# EAGLE design Sigfox_Featherwing (EAGLE 9.4.1)
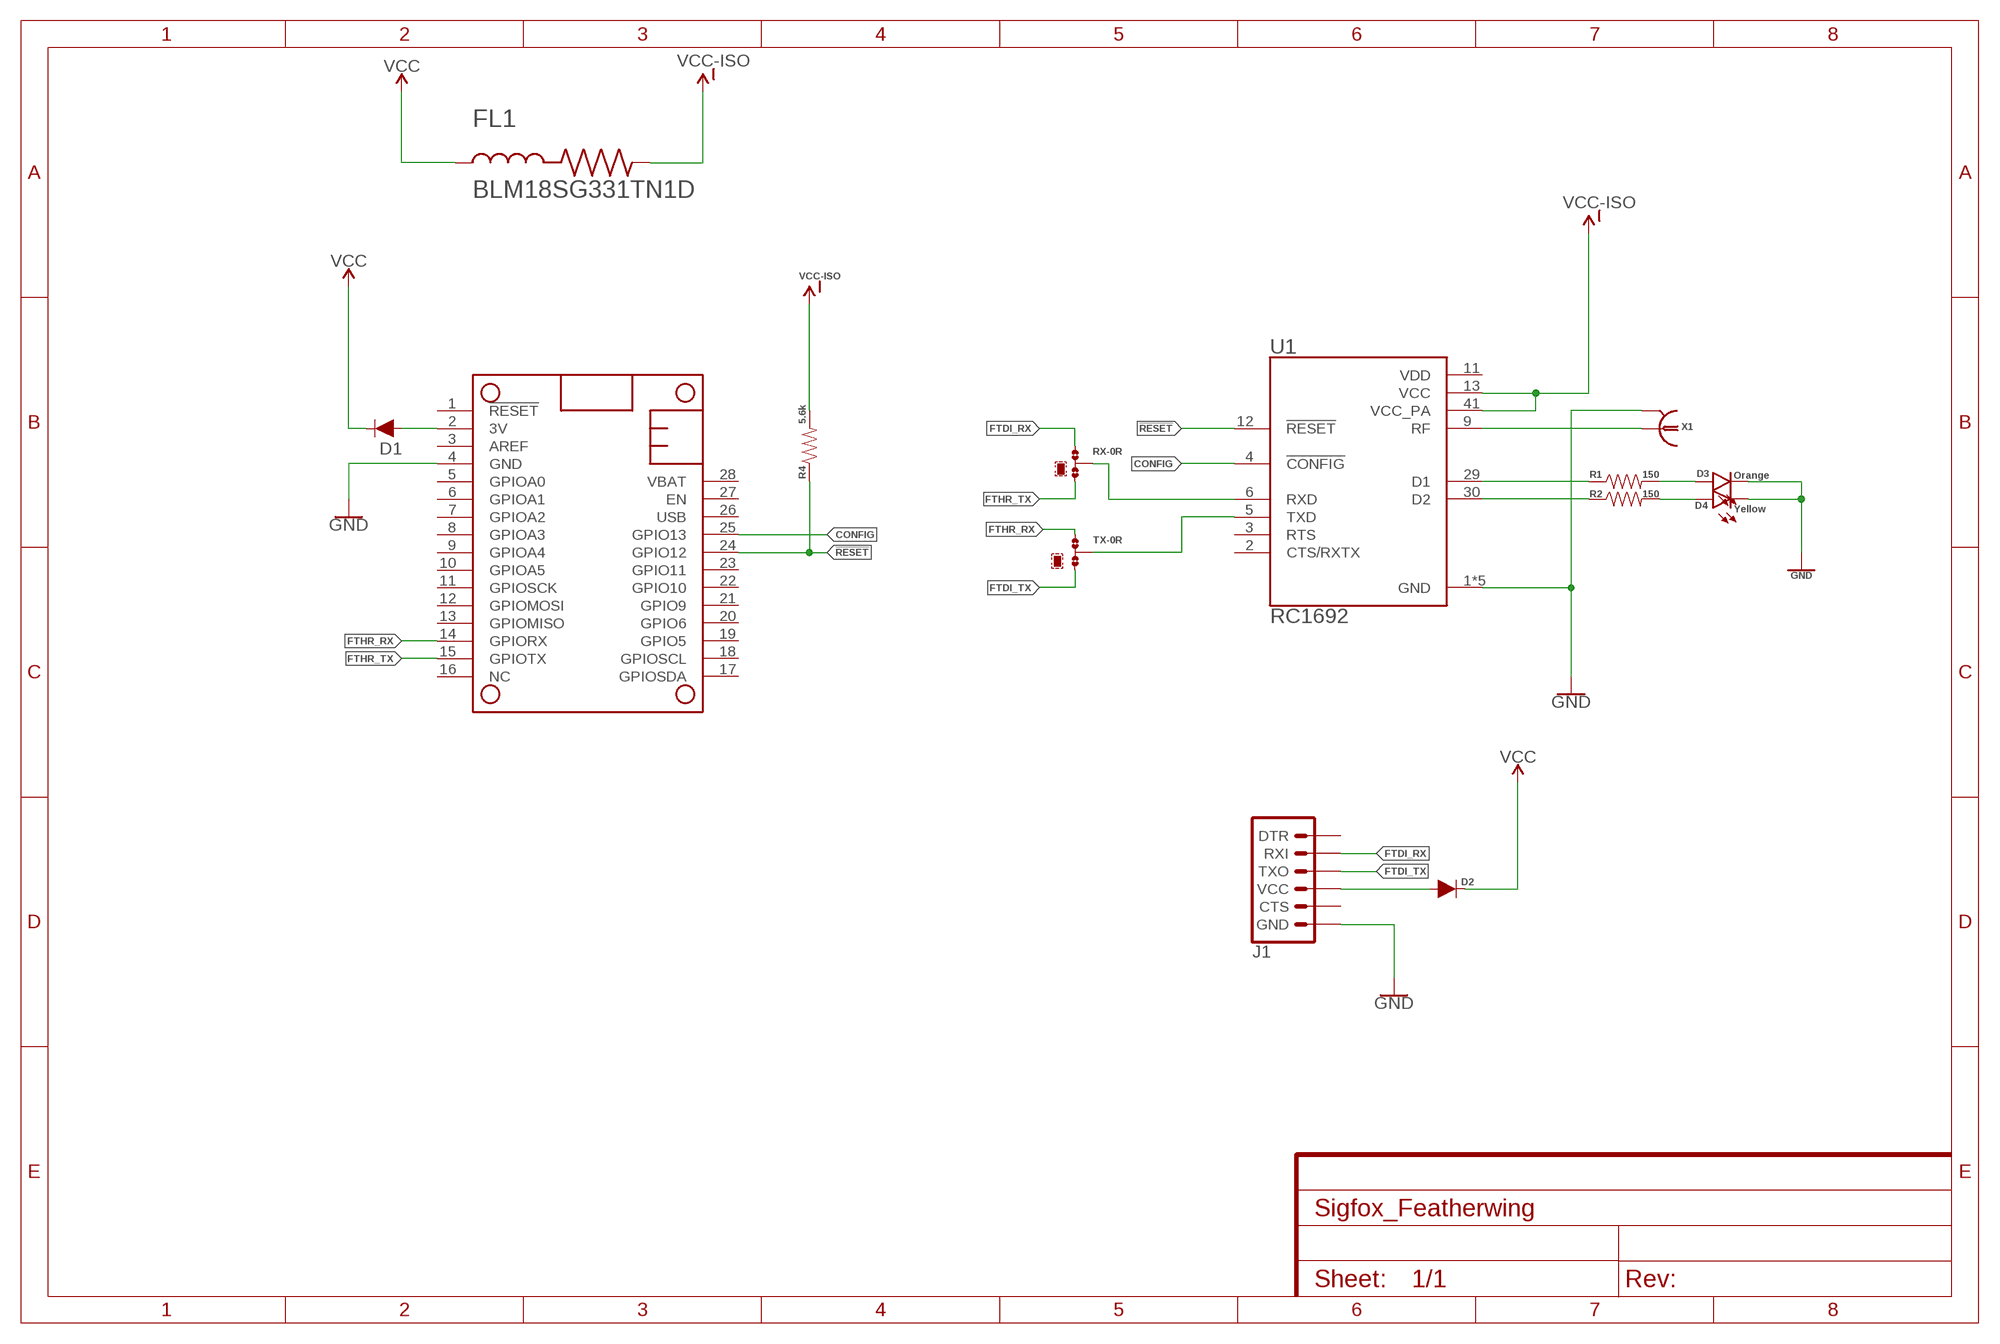
[diagram p0: schematic, sheet 1]

## Parts
D1  250mA/100V  DIODE-BAS16J  [SOD-323]
D2  250mA/100V  DIODE-BAS16J  [SOD-323]
D3  Orange  LED-YELLOW0603  [LED-0603]
D4  Yellow  LED-YELLOW0603  [LED-0603]
FL1  BLM18SG331TN1D  [BEADC1608X65N]
J1  6_PIN_SERIAL_TARGETSILK  [6_PIN_SERIAL_TARGET_SIDE_W_SILK]
MS1  FEATHERWING  [FEATHERWING]
R1  150  150OHM-0603-1/10W-1%  [0603]
R2  150  150OHM-0603-1/10W-1%  [0603]
R4  5.6k  5.6KOHM-0603-1/10W-1%  [0603]
RX  0R-JUMPB  [B0R-JMP]
TX  0R-JUMPB  [B0R-JMP]
U1  RC1692  [MODULE_RC1682-SIG]
X1  SMA-SMD  [SMA-SMD]

## Nets
3V: D1.A MS1.2(3V)
!RESET: MS1.24(GPIO12) R4.1 U1.12(!RESET)
CONFIG: MS1.25(GPIO13) U1.4(!CONFIG)
FTDI_RX: J1.P$3(RXI) RX.1
FTDI_TX: J1.P$2(TXO) TX.3
FTHR_RX: MS1.14(GPIORX) TX.1
FTHR_TX: MS1.15(GPIOTX) RX.3
GND: D3.C D4.C J1.P$6(GND) MS1.4(GND) U1.1(GND) U1.7(GND) U1.8(GND) U1.10(GND) U1.14(GND) X1.2@1 X1.2@2 X1.2@3 X1.2@4 X1.2@5 X1.2@6
N$1: U1.9(RF) X1.1
N$2: D2.A J1.P$4(VCC)
N$3: RX.2 U1.6(RXD)
N$4: TX.2 U1.5(TXD)
N$5: R1.1 U1.29(D1)
N$6: R2.1 U1.30(D2)
N$7: D3.A R1.2
N$8: D4.A R2.2
VCC: D1.C D2.C FL1.1
VCC-ISO: FL1.2 R4.2 U1.13(VCC) U1.41(VCC_PA)
Unconnected: J1.P$1(DTR) J1.P$5(CTS) MS1.1(!RESET) MS1.3(AREF) MS1.5(GPIOA0) MS1.6(GPIOA1) MS1.7(GPIOA2) MS1.8(GPIOA3) MS1.9(GPIOA4) MS1.10(GPIOA5) MS1.11(GPIOSCK) MS1.12(GPIOMOSI) MS1.13(GPIOMISO) MS1.16(NC) MS1.17(GPIOSDA) MS1.18(GPIOSCL) MS1.19(GPIO5) MS1.20(GPIO6) MS1.21(GPIO9) MS1.22(GPIO10) MS1.23(GPIO11) MS1.26(USB) MS1.27(EN) MS1.28(VBAT) U1.2(CTS/RXTX) U1.3(RTS)

## Power pins joined to a net without a drawn wire
VDD: U1.11(VDD)

## Library data of the parts
D1 D2 = SparkFun-DiscreteSemi:DIODE: Diode These are standard reverse protection diodes and small signal diodes. SparkFun Products: SparkFun SparkPunk Sound Kit <https://www.sparkfun.com/products/11177> SparkFun ESP8266 Thing <https://www.sparkfun.com/products/13231>; PROD_ID: DIO-09646
D3 = SparkFun-LED:LED-YELLOW: Yellow SMD LED Used in manufacturing several products at SparkFun. Packages: 0603 - SMD 0603 package[Product Link] <http://www.kingbrightusa.com/product.asp?catalog_name=LED&product_id=APT1608SYCK> 0603 -SMART - SMART SMD 0603 package (more efficient/more expensive) [Product Link] <http://www.osram-os.com/osram_os/en/products/product-catalog/led-light-emitting-diodes/smartled-0603/ly-l29k/index.jsp> LilyPad - SMD1206 package[Product Datasheet] <https://www.sparkfun.com/datasheets/DevTools/LilyPad/Q150YUS4.pdf> SparkFun Products: Blynk Board <https://www.sparkfun.com/products/13794> IOIO-OTG <https://www.sparkfun.com/products/13613> XBee Explorer Serial <https://www.sparkfun.com/products/13225>; PROD_ID: DIO-09003; VALUE: Yellow
D4 = SparkFun-LED:LED-YELLOW: Yellow SMD LED Used in manufacturing several products at SparkFun. Packages: 0603 - SMD 0603 package[Product Link] <http://www.kingbrightusa.com/product.asp?catalog_name=LED&product_id=APT1608SYCK> 0603 -SMART - SMART SMD 0603 package (more efficient/more expensive) [Product Link] <http://www.osram-os.com/osram_os/en/products/product-catalog/led-light-emitting-diodes/smartled-0603/ly-l29k/index.jsp> LilyPad - SMD1206 package[Product Datasheet] <https://www.sparkfun.com/datasheets/DevTools/LilyPad/Q150YUS4.pdf> SparkFun Products: Blynk Board <https://www.sparkfun.com/products/13794> IOIO-OTG <https://www.sparkfun.com/products/13613> XBee Explorer Serial <https://www.sparkfun.com/products/13225>; PROD_ID: DIO-09003
FL1 = BLM18SG331TN1D:BLM18SG331TN1D: IC REG BOOST ADJ 85MA TSOT23-8; AVAILABILITY: Unavailable; DESCRIPTION: 330 Ohms @ 100MHz 1 Power Line Ferrite Bead 0603 _1608 Metric_ 1.5A 70mOhm; MF: Murata Electronics; MP: BLM18SG331TN1D; PACKAGE: 1608 Murata; PRICE: None
J1 = SparkFun-Connectors:6_PIN_SERIAL_TARGET: 6-pin header connection for use with the "FTDI BASIC" pinout - TARGET SIDE. Also known as "Arduino Serial Program Header". It is used to mate with our FTDI Basic serial programmers using the Arduino IDE. Note, this device has "TARGET" in the name. It is intended to be used on a design that contains a target micro-controller that you wish to program. The "sister" device, named "CABLE" is inteneded to be used on a design that usually lives on the end of your USB cable and prvides the converter chip (FTDI232 or FTDI231x) to commnicate serial RX/TX. You can populate with some of these: Break Away Headers - Straight <https://www.sparkfun.com/products/116> (PRT-00116) For reference (or to suit your programming needs) check out these designs: SparkFun FTDI Basic Breakout - 5V <https://www.sparkfun.com/products/9716> (DEV-09716) SparkFun FTDI Basic Breakout - 3.3V <https://www.sparkfun.com/products/9873> (DEV-09873) SparkFun FTDI SmartBasic <https://www.sparkfun.com/products/12935> (DEV-12935) SparkFun Beefy 3 - FTDI Basic Breakout <https://www.sparkfun.com/products/13746> (DEV-13746)
MS1 = adafruit:FEATHERWING
R1 R2 = SparkFun-Resistors:150OHM: 150Ω resistor A resistor is a passive two-terminal electrical component that implements electrical resistance as a circuit element. Resistors act to reduce current flow, and, at the same time, act to lower voltage levels within circuits. - Wikipedia; PROD_ID: RES-11028
R4 = SparkFun-Resistors:5.6KOHM: 5.6kΩ resistor A resistor is a passive two-terminal electrical component that implements electrical resistance as a circuit element. Resistors act to reduce current flow, and, at the same time, act to lower voltage levels within circuits. - Wikipedia; PROD_ID: RES-12378
RX TX = jump-0r-smd:0R-JUMP: SMD 0R 0805 Jumper
U1 = RC1692:RC1692: SIGFOX RF Module 868MHz 25, 4x12, 7x3, 3mm; AVAILABILITY: Unavailable; DESCRIPTION: RC1682-SIG; MF: Radiocrafts AS; MP: RC1682-SIG; PACKAGE: Module Radiocrafts; PRICE: None
X1 = con-coax:SMA-SMD: SMA 50 Ohm Straight Jack Receptacle - Surface Mount www.johnsoncomponents.com Source: http://catalog.digikey.com .. 142-0711-201, 205, 202, 206.pdf; OC_FARNELL: unknown; OC_NEWARK: unknown

## Board
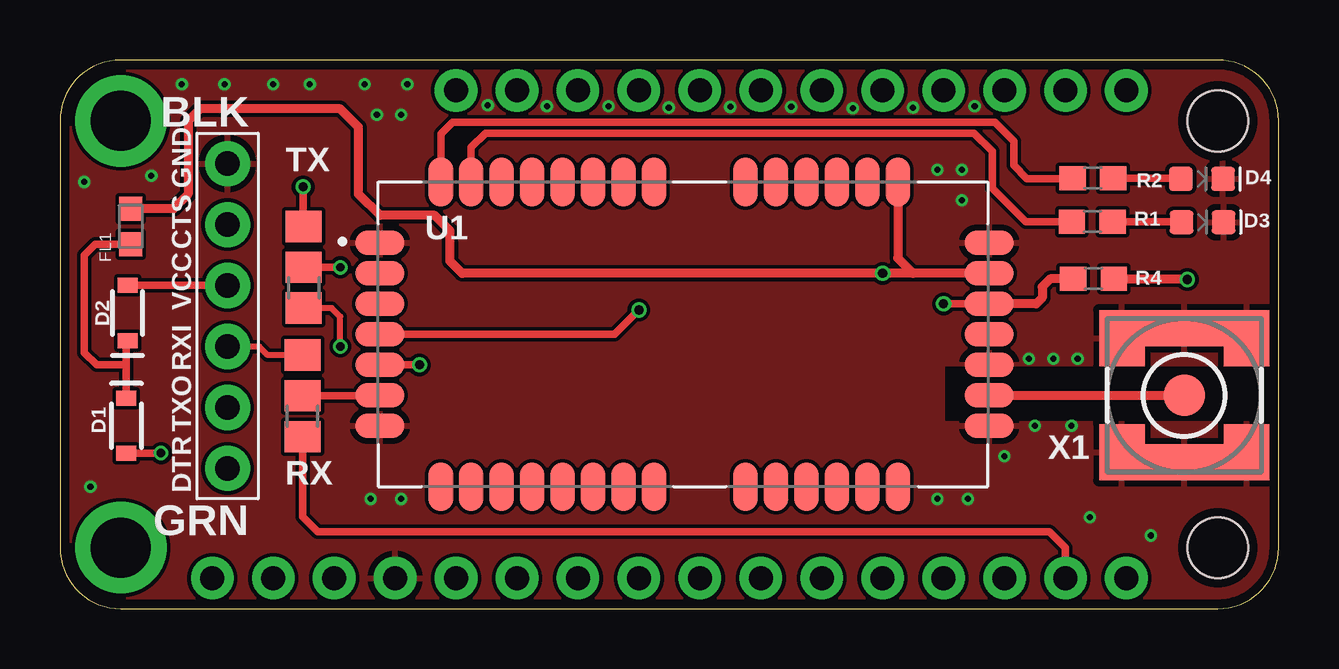
[diagram p1: board, top side]
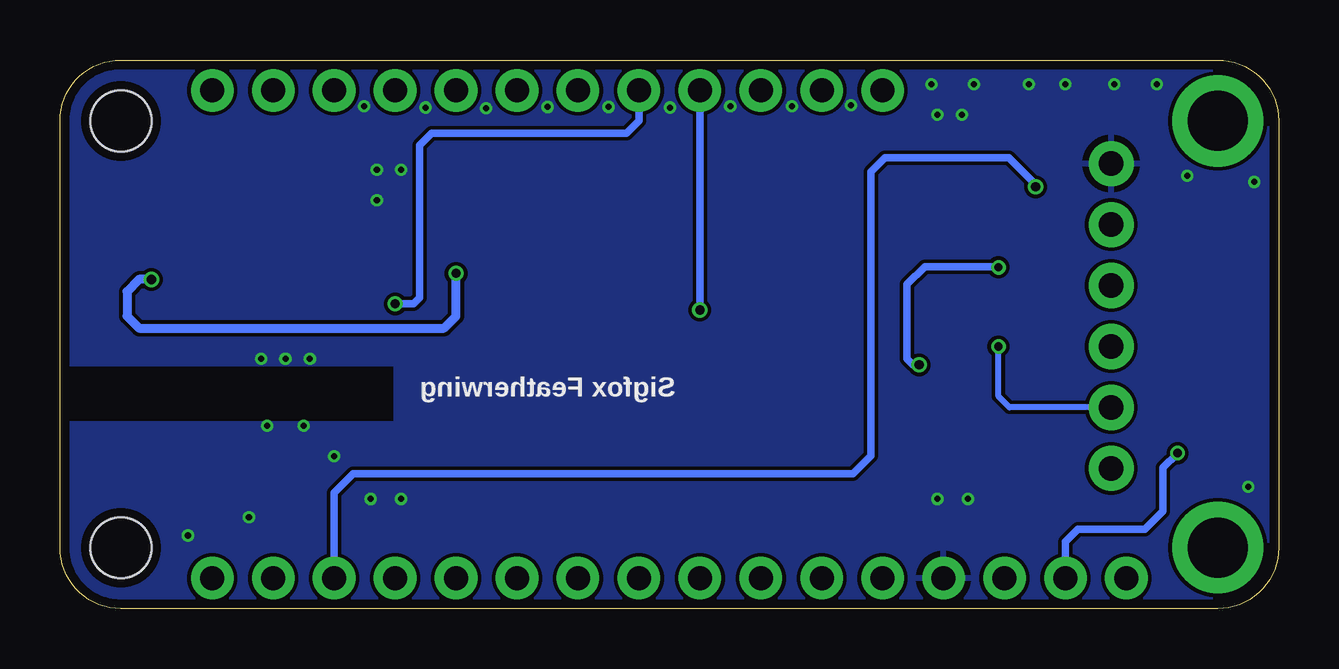
[diagram p2: board, bottom side, seen from below]

Size 50.8 x 22.86 mm. Coordinates in mm from the lower left corner, seen from the top.
Copper layers (1*16): Top 0.035559375mm / dielectric 1.6mm / Bottom 0.035559375mm
Design rules "oshpark-2layer": minimum track width 6mil, minimum drill 10mil, track to track 6mil, track to pad 6mil, pad to pad 6mil, via to via 6mil, smd to smd 6mil, copper to edge 15mil, drill to drill 6mil, minimum pad ring 5mil, minimum via ring 5mil, stop-mask expansion 2.5mil, vias tented up to drill 0mil, thermal gap 10mil

### Footprints (pad centres in the part's own frame; a part is rotated, then mirrored left to right if it is on the bottom)
SOD-323 = smd 0.63 x 0.83: A 1.15,0; C -1.15,0
LED-0603 = smd 1 x 1: A -0.877,0; C 0.877,0
BEADC1608X65N = smd 1 x 0.97: 1 -0.735,0; 2 0.735,0
6_PIN_SERIAL_TARGET_SIDE_W_SILK = drill 1.016 pad 1.88: P$1 -6.35,0; P$2 -3.81,0; P$3 -1.27,0; P$4 1.27,0; P$5 3.81,0; P$6 6.35,0
FEATHERWING = drill 1 pad 1.778: 1 6.35,1.27; 2 8.89,1.27; 3 11.43,1.27; 4 13.97,1.27; 5 16.51,1.27; 6 19.05,1.27; 7 21.59,1.27; 8 24.13,1.27; 9 26.67,1.27; 10 29.21,1.27; 11 31.75,1.27; 12 34.29,1.27; 13 36.83,1.27; 14 39.37,1.27; 15 41.91,1.27; 16 44.45,1.27; 17 44.45,21.59; 18 41.91,21.59; 19 39.37,21.59; 20 36.83,21.59; 21 34.29,21.59; 22 31.75,21.59; 23 29.21,21.59; 24 26.67,21.59; 25 24.13,21.59; 26 21.59,21.59; 27 19.05,21.59; 28 16.51,21.59 | drill 2.5 pad 3.81: P$1 2.54,20.32; P$2 2.54,2.54 | hole 2.54: 48.26,20.32; 48.26,2.54
0603 = smd 1.1 x 1: 1 -0.85,0; 2 0.85,0
B0R-JMP = smd 1.5 x 1.3: 1 0,1.7; 2 0,0; 3 0,-1.7
MODULE_RC1682-SIG = smd 2.032 x 1.016: 1 -13.335,3.81; 2 -13.335,2.54; 3 -13.335,1.27; 4 -13.335,0; 5 -13.335,-1.27; 6 -13.335,-2.54; 7 -13.335,-3.81; 8 12.065,-3.81; 9 12.065,-2.54; 10 12.065,-1.27; 11 12.065,0; 12 12.065,1.27; 13 12.065,2.54; 14 12.065,3.81 | smd 1.016 x 2.032: 15 -10.795,-6.35; 16 -9.525,-6.35; 17 -8.255,-6.35; 18 -6.985,-6.35; 19 -5.715,-6.35; 20 -4.445,-6.35; 21 -3.175,-6.35; 22 -1.905,-6.35; 23 -1.905,6.35; 24 -3.175,6.35; 25 -4.445,6.35; 26 -5.715,6.35; 27 -6.985,6.35; 28 -8.255,6.35; 29 -9.525,6.35; 30 -10.795,6.35; 31 1.905,6.35; 32 1.905,-6.35; 33 3.175,6.35; 34 3.175,-6.35; 35 4.445,6.35; 36 4.445,-6.35; 37 5.715,6.35; 38 5.715,-6.35; 39 6.985,6.35; 40 6.985,-6.35; 41 8.255,6.35; 42 8.255,-6.35
SMA-SMD = smd 1.73 x 1.73: 1 0,0 | smd 2.35 x 1.9: 2@1 -2.375,2.6; 2@2 -2.375,-2.6; 2@3 2.375,-2.6; 2@4 2.375,2.6 | smd 1.5 x 3.4: 2@5 -2.8,0; 2@6 2.8,0

### Placement (x,y rotation side)
D1  2.77,7.62 270 top
D2  2.82,12.32 90 top
D3  47.62,16.1 0 top
D4  47.6,17.91 0 top
FL1  2.95,15.93 90 top
J1  6.99,12.19 90 top
MS1  0,0 0 top
R1  43.03,16.13 0 top
R2  43.05,17.93 0 top
R4  43.08,13.74 0 top
RX  10.11,8.86 0 top
TX  10.16,14.22 0 top
U1  26.67,11.43 0 top
X1  46.86,8.89 90 top

### Tracks (layer width: path | path; a pad name or v marks a point on that pad's centre or on a via)
3V  (via drill 0.35)
  Top 0.305: v4.22,6.48 4.21,6.47 D1.A
  Bottom 0.305: MS1.2 8.89,2.79 8.38,3.3 5.59,3.3 4.83,4.06 4.83,5.87 v4.22,6.48
!RESET  (via drill 0.38)
  Top 0.305: U1.12 v36.83,12.7
  Top 0.381: R4.1 41.27,13.74 40.95,13.41 40.95,12.95 40.69,12.7 U1.12
  Bottom 0.305: v36.83,12.7 36.07,12.7 35.81,12.95 35.81,19.3 35.31,19.81 27.18,19.81 26.67,20.32 MS1.24
CONFIG  (via drill 0.38)
  Top 0.305: U1.4 23.11,11.43 v24.13,12.45
  Bottom 0.305: v24.13,12.45 MS1.25
FTDI_RX
  Top 0.254: RX.1 8.66,10.56 8.31,10.92 J1.P$3
FTDI_TX  (via drill 0.35)
  Top 0.254: TX.3 11.33,12.52 11.68,12.17 v11.68,10.92
  Bottom 0.254: J1.P$2 11.23,8.38 11.68,8.84 v11.68,10.92
FTHR_RX  (via drill 0.38)
  Top 0.305: 10.24,16 TX.1 10.13,15.95 v10.13,17.58
  Bottom 0.305: MS1.14 39.37,4.83 38.58,5.61 17.75,5.61 16.99,6.38 16.99,18.21 16.41,18.8 11.25,18.8 10.13,17.68 v10.13,17.58
FTHR_TX
  Top 0.305: MS1.15 41.91,2.54 41.25,3.2 10.74,3.2 10.11,3.83 RX.3
GND  (via drill 0.25)
  other vias: 13.21,20.57 14.22,20.57 12.7,21.84 14.48,21.84 17.83,20.98 20.29,20.93 22.86,20.93 25.37,20.88 30.48,20.9 27.94,20.9 33.05,20.85 35.56,20.88 38.13,20.93 5.08,21.84 6.86,21.84 8.89,21.84 10.41,21.84 40.64,7.62 42.16,7.62 42.42,10.41 41.4,10.41 40.39,10.41 45.47,3.05 42.93,3.81 14.22,4.57 12.95,4.57 1.27,5.08 3.81,18.03 1.02,17.78 36.58,4.57 37.85,4.57 39.37,6.35 37.59,18.29 36.58,18.29 37.59,17.02
  pour Top: 0,0 50.8,0 50.8,7.62 49.53,7.62 49.53,7.75 43.43,7.75 36.83,7.75 36.83,8.89 36.83,10.16 50.8,10.16 50.8,22.86 46.99,22.86 0,22.86
  pour Bottom: 0,0 0,22.86 50.8,22.86 50.8,10.16 36.83,10.16 36.83,7.75 50.29,7.75 50.8,7.75 50.8,0
N$1
  Top 0.381: U1.9 X1.1
N$2
  Top 0.305: D2.A 6.98,13.47 J1.P$4
N$3
  Top 0.305: RX.2 13.31,8.87 U1.6
N$4  (via drill 0.35, 0.38)
  Top 0.305: v11.68,14.22 TX.2 | U1.5 v14.99,10.16
  Bottom 0.305: v11.68,14.22 11.71,14.25 14.76,14.25 15.49,13.51 15.49,10.41 15.24,10.16 v14.99,10.16
N$5
  Top 0.305: R1.1 40.26,16.13 38.86,17.53 38.86,19.05 38.1,19.81 17.73,19.81 17.14,19.23 U1.29
N$6
  Top 0.305: U1.30 15.88,19.79 16.36,20.27 38.96,20.27 39.75,19.48 39.75,18.47 40.31,17.91 42.18,17.91 R2.1
N$7
  Top 0.305: R1.2 46.75,16.13
  Top 0.381: 46.75,16.13 D3.A
N$8
  Top 0.305: R2.2 46.7,17.93 D4.A
VCC
  Top 0.305: D2.C 2.77,11.12 2.77,10.16 | 2.77,10.16 D1.C | 2.77,10.16 1.52,10.16 1.02,10.67 1.02,14.73 1.48,15.19 FL1.1
VCC-ISO  (via drill 0.38)
  Top 0.381: U1.13 35.56,13.97 | 35.56,13.97 v34.29,13.97 16.76,13.97 16.26,14.48 16.26,15.75 15.62,16.38 13.34,16.38 12.45,17.27 12.45,20.07 11.68,20.83 5.84,20.83 5.33,20.32 5.33,17.27 4.72,16.66 FL1.2 | U1.41 34.92,14.61 35.56,13.97 | R4.2 46.97,13.74 v46.99,13.72
  Bottom 0.381: v46.99,13.72 47.5,13.72 48.01,13.21 48.01,12.19 47.5,11.68 34.8,11.68 34.29,12.19 v34.29,13.97

### Text on the board
bNames: Sigfox Featherwing